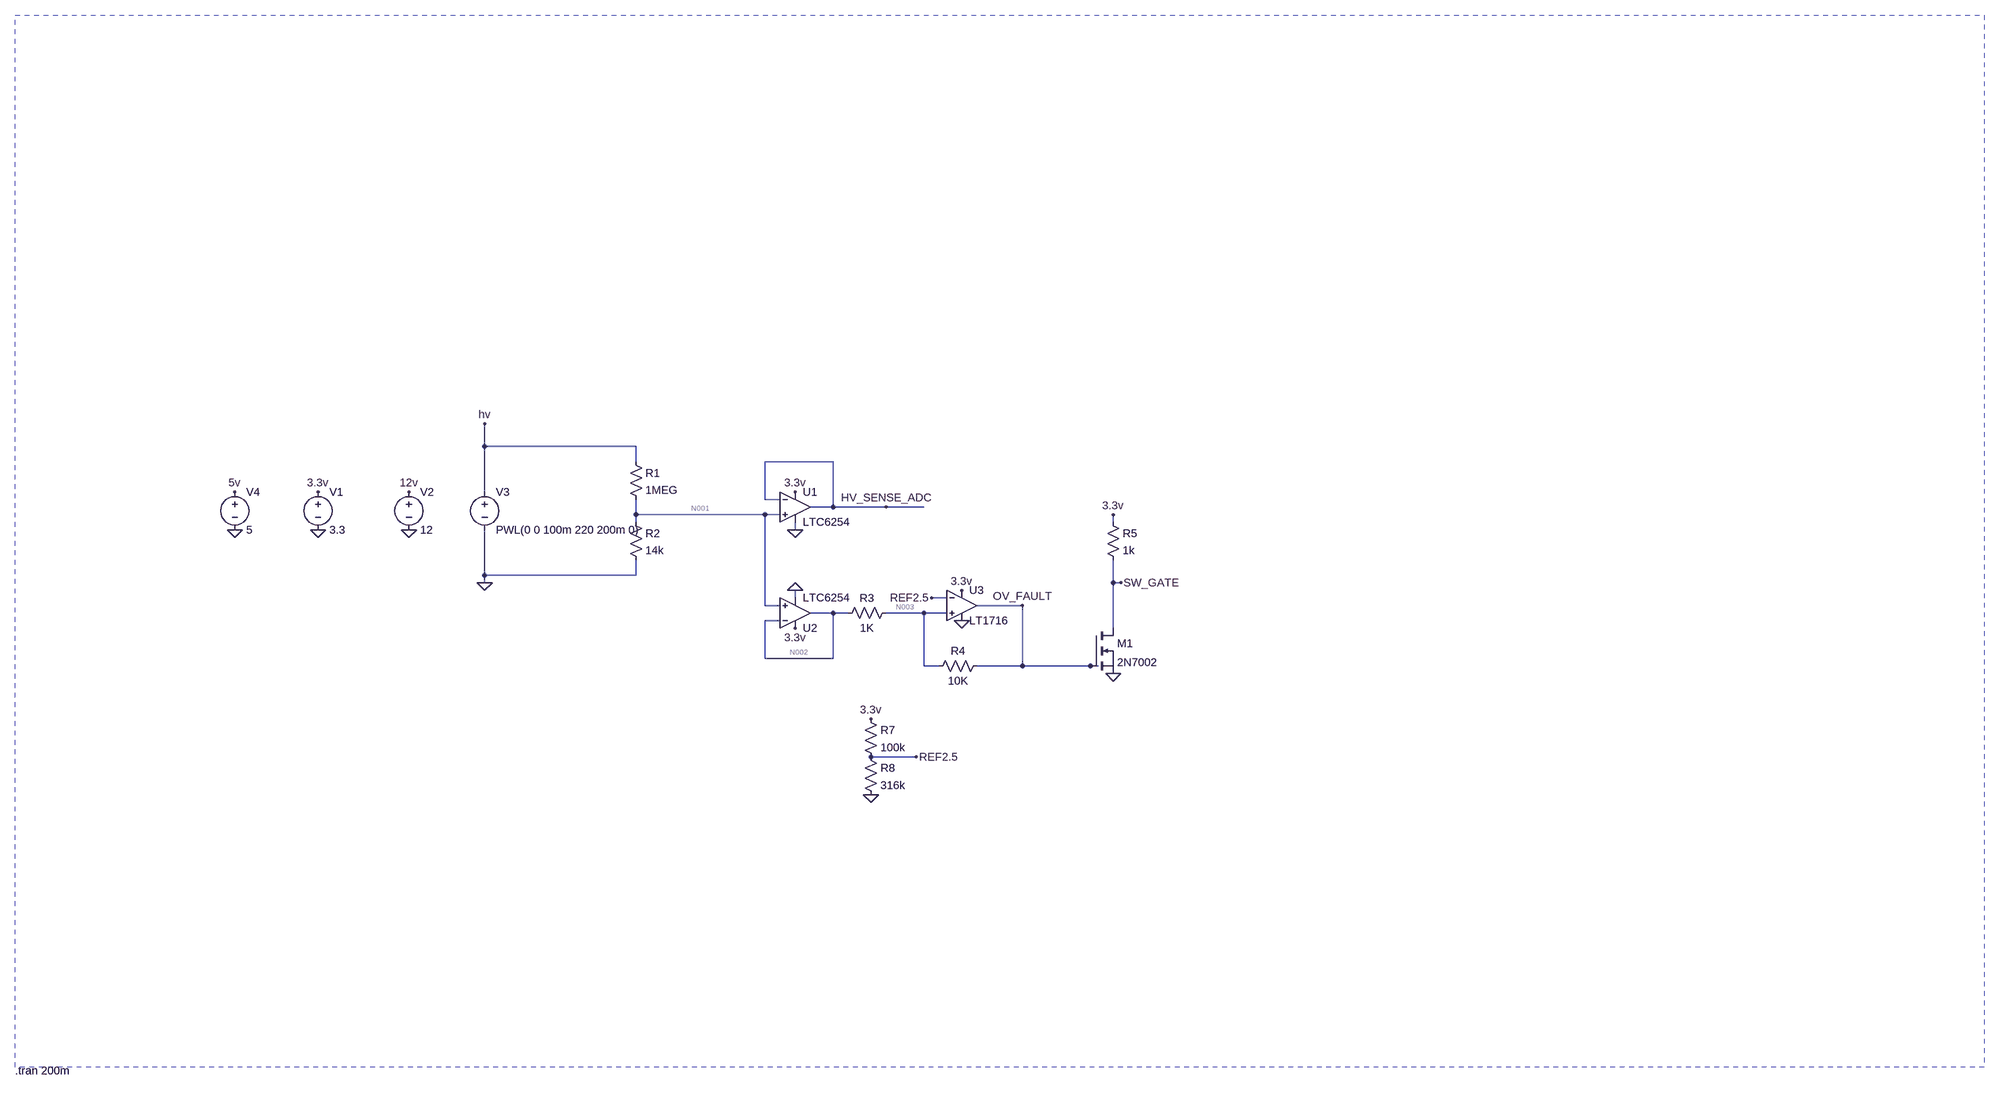
[diagram p0: schematic hv_control_circuitry.asc]
* hv_control_circuitry.asc
V1 3.3v 0 3.3
V2 12v 0 12
V3 hv 0 PWL(0 0 100m 220 200m 0)
R1 hv N001 1MEG
R2 N001 0 14k
V4 5v 0 5
R7 3.3v REF2.5 100k
R8 REF2.5 0 316k
XU3 N003 REF2.5 3.3v 0 OV_FAULT LT1716  ; pins In+ In- V+ V- OUT
R3 N003 N002 1K
R4 OV_FAULT N003 10K
M1 SW_GATE OV_FAULT 0 0 2N7002
R5 3.3v SW_GATE 1k
* U1: LTC6254 (symbol Opamps\LTC6254 not available, pins judged from their places): In+=N001 In-=HV_SENSE_ADC V+=3.3v V-=0 OUT=HV_SENSE_ADC
* U2: LTC6254 (symbol Opamps\LTC6254 not available, pins judged from their places): In+=N001 In-=N002 V+=3.3v V-=0 OUT=N002
.model NMOS NMOS
.model PMOS PMOS
.lib standard.mos
.tran 200m
.lib LTC1.lib
.backanno
.end

* Results of the author's LTspice run, read from the files saved beside the schematic
* Operating Point, zero values left out:
*   V(3.3v) = 3.3 V
*   V(12v) = 12 V
*   V(n001) = 3.192 mV
*   V(5v) = 5 V
*   V(ref2.5) = 2.507 V
*   V(ov_fault) = 20.97 mV
*   V(n003) = 4.851 mV
*   V(n002) = 3.236 mV
*   V(sw_gate) = 3.3 V
*   V(hv_sense_adc) = 3.236 mV
*   Id(M1) = 3.337 pA
*   Is(M1) = -3.337 pA
*   I(R5) = 6.639 pA
*   I(R4) = 1.612 µA
*   I(R3) = 1.615 µA
*   I(R8) = 7.933 µA
*   I(R7) = 7.933 µA
*   I(R2) = 228 nA
*   I(R1) = -3.192 nA
*   I(V3) = 3.192 nA
*   I(V1) = -3.263 mA
*   Ix(u3:1) = -3.506 nA
*   Ix(u3:2) = 1.709 pA
*   Ix(u3:3) = 41.99 µA
*   Ix(u3:4) = -40.38 µA
*   Ix(u3:5) = -1.612 µA
*   Ix(u1:1) = 103.4 nA
*   Ix(u1:2) = -1.607 mA
*   Ix(u1:3) = -115.6 nA
*   Ix(u1:4) = -103.4 nA
*   Ix(u1:5) = 1.607 mA
*   Ix(u2:1) = 1.719 µA
*   Ix(u2:2) = -1.607 mA
*   Ix(u2:3) = -115.6 nA
*   Ix(u2:4) = -103.3 nA
*   Ix(u2:5) = 1.606 mA
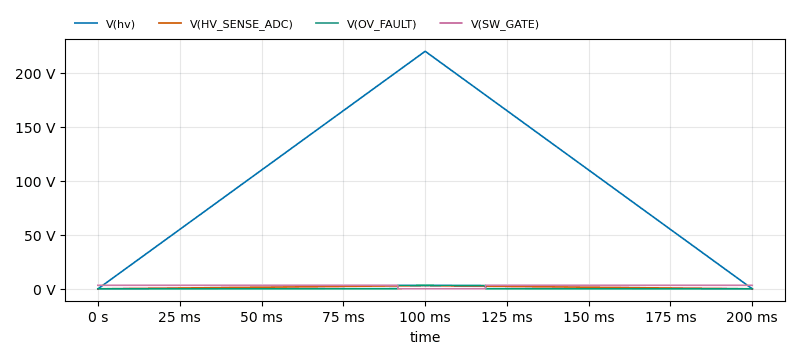
[diagram p1: Transient Analysis of hv_control_circuitry.asc, plotted from the saved traces]
* Transient Analysis, 1 run:
*   V(hv): min 0 V, max 220 V, average 110 V, rms 128 V, last 0 V
*   V(HV_SENSE_ADC): min 3.236 mV, max 3.001 V, average 1.509 V, rms 1.753 V, last 3.237 mV
*   V(OV_FAULT): min 20.97 mV, max 3.227 V, average 487.3 mV, rms 1.17 V, last 20.98 mV
*   V(SW_GATE): min 12.03 mV, max 3.337 V, average 2.859 V, rms 3.071 V, last 3.3 V